# EAGLE design plantSensor (EAGLE 6.4)
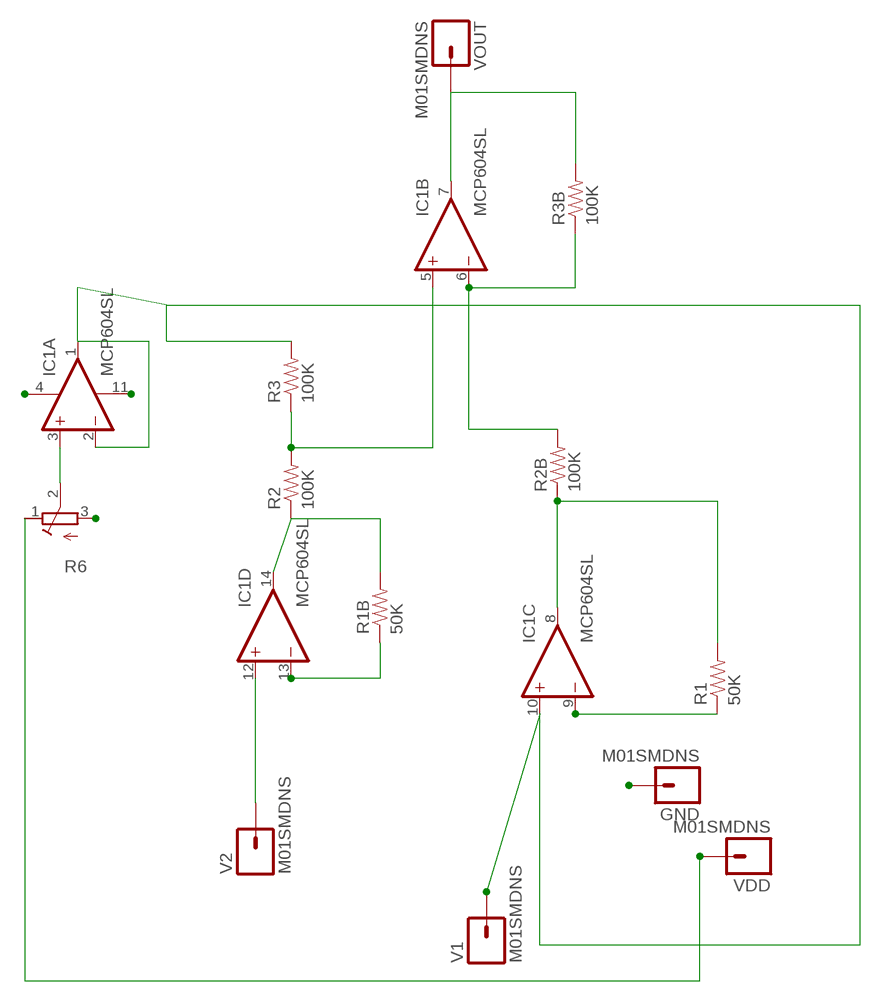
[diagram p0: schematic, sheet 1]

## Parts
GND  M01SMDNS  [1X01NS]
IC1  MCP604SL  [SO14]
R1  50K  RESISTOR  [0805]
R1B  50K  RESISTOR  [0805]
R2  100K  RESISTOR  [0805]
R2B  100K  RESISTOR  [0805]
R3  100K  RESISTOR  [0805]
R3B  100K  RESISTOR  [0805]
R6  R-TRIMM3314G  [RTRIM3314G]
V1  M01SMDNS  [1X01NS]
V2  M01SMDNS  [1X01NS]
VDD  M01SMDNS  [1X01NS]
VOUT  M01SMDNS  [1X01NS]

## Nets
GND: GND.1 IC1.11(P:V-) R6.3(A)
N$3: IC1.13(D:-IN) R1B.1
N$4: IC1.12(D:+IN) V2.1
N$6: IC1.3(A:+IN) R6.2(S)
N$7: IC1.5(B:+IN) R2.2 R3.1
N$92: IC1.9(C:-IN) R1.1
N$93: IC1.8(C:OUT) R1.2 R2B.1
N$96: IC1.14(D:OUT) R1B.2 R2.1
N$100: IC1.6(B:-IN) R2B.2 R3B.1
N$102: IC1.7(B:OUT) R3B.2 VOUT.1
VDD: IC1.4(P:V+) R6.1(E) VDD.1
VRF: IC1.1(A:OUT) IC1.2(A:-IN) IC1.10(C:+IN) R3.2 V1.1

## Library data of the parts
GND V1 V2 VDD VOUT = SparkFun-Connectors:M01: Header 1 Standard 1-pin 0.1" header. Use with straight break away headers (SKU : PRT-00116), right angle break away headers (PRT-00553), swiss pins (PRT-00743), machine pins (PRT-00117), and female headers (PRT-00115).
IC1 = linear:MCP604: Quad Op Amp 2.7V to 6.0V Single Supply CMOS Source: http://ww1.microchip.com/downloads/en/DeviceDoc/21314g.pdf
R1 R1B R2 R2B R3 R3B = SparkFun:RESISTOR: Resistor Basic schematic elements and footprints for 0603, 1206, and PTH 1/10th watt (small) resistors.
R6 = rcl:R-TRIMM: Trimm resistor

## Board
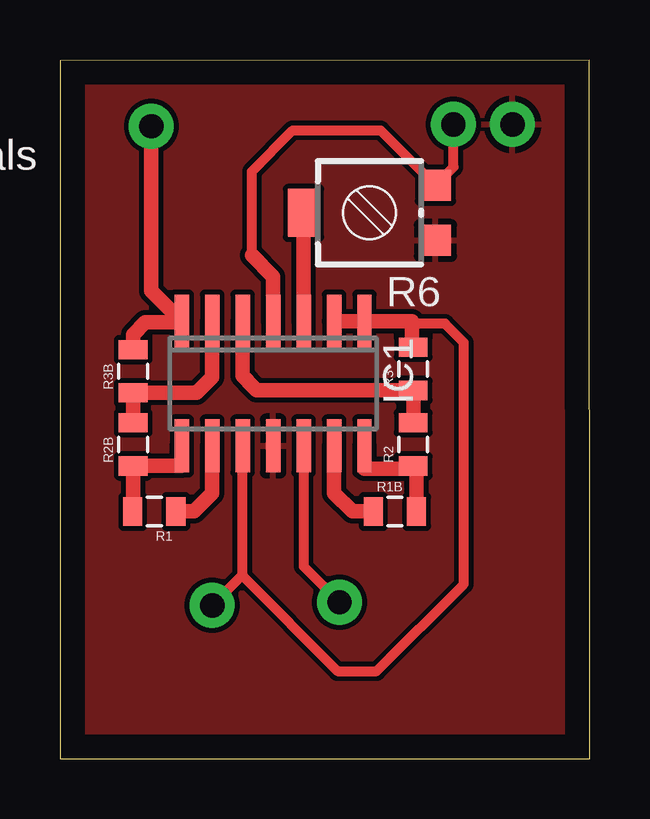
[diagram p1: board, top side]

Size 22.1 x 29.12 mm. Coordinates in mm from the lower left corner, seen from the top.
Outline: 0,0 22.1,0 22.07,29.12 0,29.1 0,0
Copper layers (1*16): Top 0.035mm / dielectric 1.5mm / Bottom 0.035mm
Design rules "default": minimum track width 10mil, minimum drill 24mil, track to track 8mil, track to pad 8mil, pad to pad 8mil, via to via 8mil, smd to smd 8mil, copper to edge 40mil, drill to drill 8mil, minimum pad ring 10mil, minimum via ring 8mil, stop-mask expansion 4mil, vias tented up to drill 0mil, thermal gap 10mil

### Footprints (pad centres in the part's own frame; a part is rotated, then mirrored left to right if it is on the bottom)
1X01NS = drill 1.016 pad 1.88: 1 0,0
SO14 = smd 0.6 x 2.2: 1 -3.81,-2.6; 2 -2.54,-2.6; 3 -1.27,-2.6; 4 0,-2.6; 5 1.27,-2.6; 6 2.54,-2.6; 7 3.81,-2.6; 8 3.81,2.6; 9 2.54,2.6; 10 1.27,2.6; 11 0,2.6; 12 -1.27,2.6; 13 -2.54,2.6; 14 -3.81,2.6
0805 = smd 0.8 x 1.2: 1 -0.9,0; 2 0.9,0
RTRIM3314G = smd 1.3 x 1.3: 1 1.15,-2.75; 3 -1.15,-2.75 | smd 2 x 1.3: 2 0,2.75

### Placement (x,y rotation side)
GND  18.87,26.44 0 top
IC1  8.89,15.65 180 top
R1  3.94,10.31 180 top
R1B  13.97,10.31 0 top
R2  14.73,13.11 90 top
R2B  3.05,13.11 90 top
R3  14.73,16.26 90 top
R3B  3.05,16.15 90 top
R6  12.9,22.76 90 top
V1  6.35,6.4 90 top
V2  11.66,6.53 90 top
VDD  16.41,26.44 0 top
VOUT  3.81,26.37 0 top

### Tracks (layer width: path | path; a pad name or v marks a point on that pad's centre or on a via)
GND
  pour Top: 24.84,29.95 24.54,-1.83 -0.51,-1.37 -1.22,30.07
N$3
  Top 0.61: IC1.13 11.43,11.07 12.19,10.31 R1B.1
N$4
  Top 0.406: IC1.12 10.16,8.03 V2.1
N$6
  Top 0.61: R6.2 IC1.3
N$7
  Top 0.61: R2.2 R3.1 8.2,15.37 7.85,15.72 7.85,15.75 7.62,15.98 IC1.5
N$92
  Top 0.61: R1.1 5.59,10.31 6.35,11.07 IC1.9
N$93
  Top 0.254: R2B.1 3.16,12.21 | 3.05,10.7 R1.2
  Top 0.61: R1.2 R2B.1 5.08,12.22 IC1.8
N$96
  Top 0.61: IC1.14 12.7,12.09 14.99,12.09 14.87,12.21 R2.1 14.87,12.07 R1B.2
N$100
  Top 0.61: R2B.2 R3B.1 5.7,15.25 6.35,15.9 IC1.6
N$102
  Top 0.61: R3B.2 3.05,17.68 3.56,18.19 5.02,18.19 IC1.7 3.81,19.52 VOUT.1
VDD
  Top 0.406: 8,20.98 8,24.49 9.7,26.19 13.37,26.19 R6.1 16.41,24.66 VDD.1
  Top 0.61: 8,20.98 8.89,20.09 IC1.4
VRF
  Top 0.406: V1.1 7.62,7.67 IC1.10 7.62,12.9 7.6,12.88 7.6,7.65 11.58,3.66 13.21,3.66 16.84,7.29 16.84,17.35 16.05,18.14 14.68,18.14
  Top 0.61: IC1.2 IC1.1 14.68,18.25 14.68,18.14 14.68,17.16 R3.2

### Text on the board
tPlace: Daskals